# Altium schematic sheet ESP32.SchDoc: =ProjectName
size A4; CheckedBy: DatNB; Author: Ven; CompanyName: Nacentech; Organization: IMET
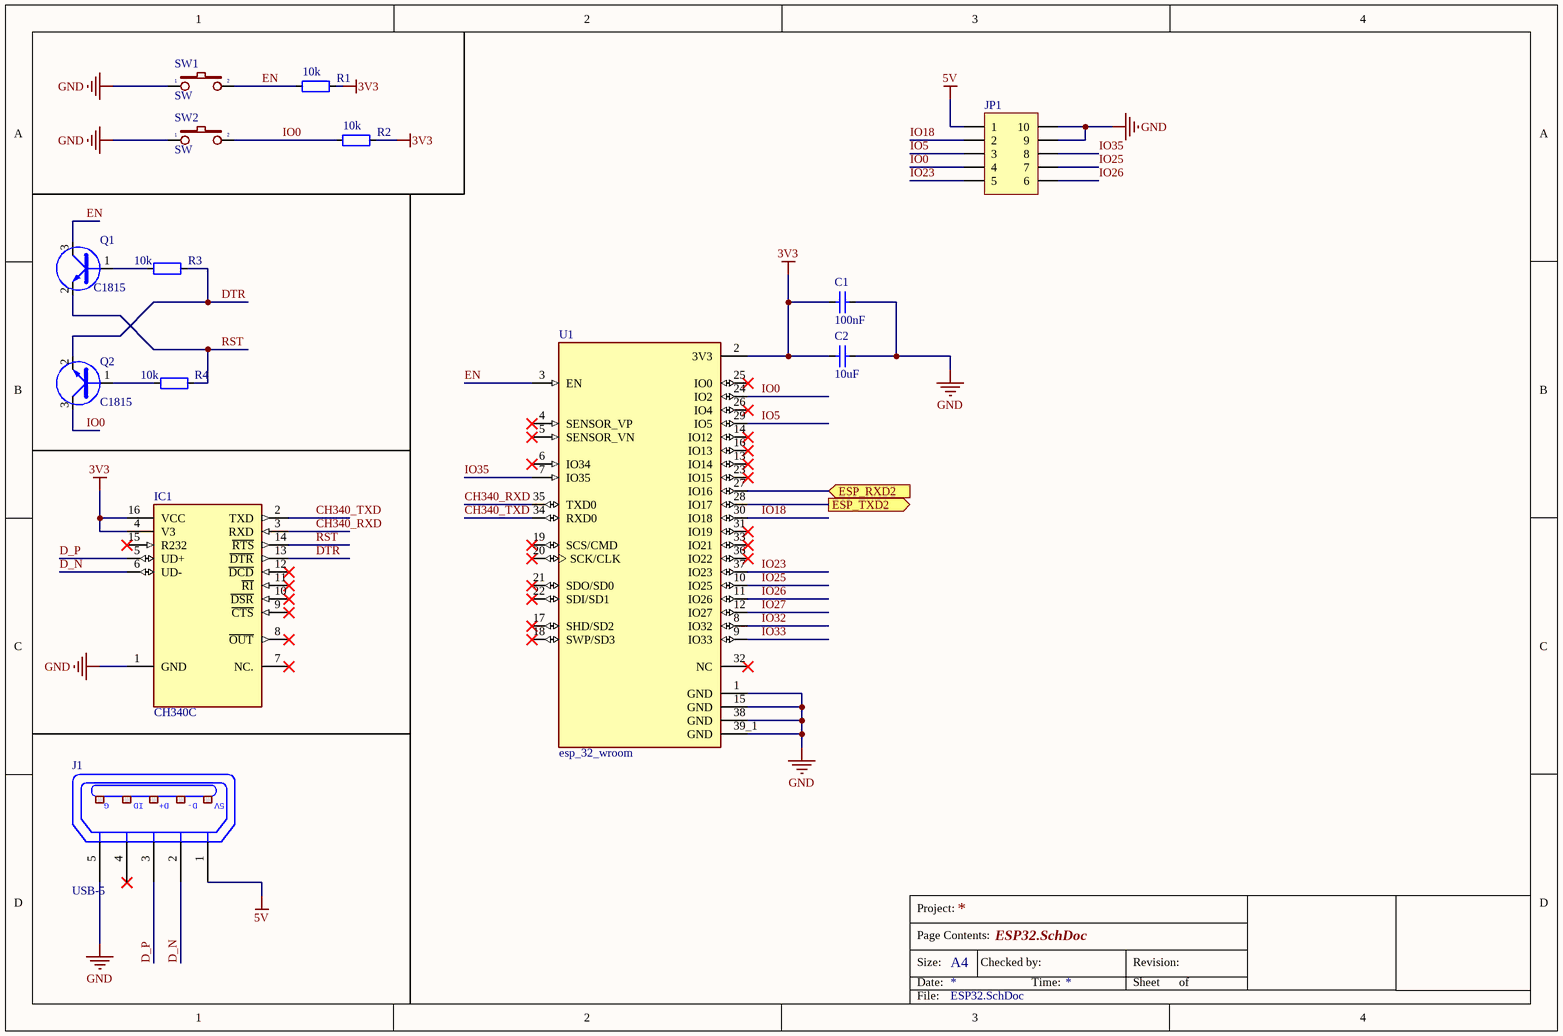
[diagram p0: ESP32.SchDoc]

## Parts
C1  100nF  [CAP_0805]
C2  10uF  [CAP_0805]
IC1  CH340C  [SO16]
J1  USB-5  [USB-M1]
JP1  JP 2x5 2.54  [JP5-D2T]  (value not drawn)
Q1  C1815  [SOT23D]
Q2  C1815  [SOT23D]
R1  10k  [RES-SMD-0805]
R2  10k  [RES-SMD-0805]
R3  10k  [RES-SMD-0805]
R4  10k  [RES-SMD-0805]
SW1  SW  [SW2]
SW2  SW  [SW2]
U1  esp_32_wroom  [MODULE_ESP32-WROOM-32]

## Ports
ESP_RXD2 (in), ESP_TXD2 (out)

## Nets
3V3: C1.1 C2.1 IC1.4(V3) IC1.16(VCC) R1.1 R2.1 U1.2(3V3)
5V: J1.1(P1) JP1.1
GND: C1.2 C2.2 IC1.1(GND) J1.5(P5) JP1.9 JP1.10 SW1.1 SW2.1 U1.1(GND) U1.15(GND) U1.38(GND) U1.39_1(GND)
CH340_RXD: IC1.3(RXD) U1.35(TXD0)
CH340_TXD: IC1.2(TXD) U1.34(RXD0)
D_N: IC1.6(UD-) J1.2(P2)
D_P: IC1.5(UD+) J1.3(P3)
DTR: IC1.13(~{DTR}) Q2.2(E) R3.1
EN: Q1.3(C) R1.2 SW1.2 U1.3(EN)
ESP_RXD2: U1.27(IO16) ; port ESP_RXD2
ESP_TXD2: U1.28(IO17) ; port ESP_TXD2
IO0: JP1.4 Q2.3(C) R2.2 SW2.2 U1.24(IO2)
IO5: JP1.3 U1.29(IO5)
IO18: JP1.2 U1.30(IO18)
IO23: JP1.5 U1.37(IO23)
IO25: JP1.7 U1.10(IO25)
IO26: JP1.6 U1.11(IO26)
IO27: U1.12(IO27)
IO32: U1.8(IO32)
IO33: U1.9(IO33)
IO35: JP1.8 U1.7(IO35)
RST: IC1.14(~{RTS}) Q1.2(E) R4.1
NetQ1_1: Q1.1(B) R3.2
NetQ2_1: Q2.1(B) R4.2

Not connected (* = marked no-connect by the designer): IC1 7(NC.)* 8(~{OUT})* 9(~{CTS})* 10(~{DSR})* 11(~{RI})* 12(~{DCD})* 15(R232)*; J1 4(P4)*; U1 4(SENSOR_VP)* 5(SENSOR_VN)* 6(IO34)* 13(IO14)* 14(IO12)* 16(IO13)* 17(SHD/SD2)* 18(SWP/SD3)* 19(SCS/CMD)* 20(SCK/CLK)* 21(SDO/SD0)* 22(SDI/SD1)* 23(IO15)* 25(IO0)* 26(IO4)* 31(IO19)* 32(NC)* 33(IO21)* 36(IO22)*

## Notes on the sheet
- Project:
- Page Contents:
- Size:
- Date:
- A4
- Checked by:
- Time:
- Revision:
- Sheet
- of
- File:
- (in symbol USB-5) G; ID; D+; D-; 5V

## Library data of the parts
C1 C2 = CapSMD: Capacitor; Value: 33p; Published: 8-Jun-2000; LatestRevisionDate: 17-Jul-2002; LatestRevisionNote: Re-released for DXP Platform.; PackageReference: RAD-0.3; Publisher: Altium Limited
J1 = USB-5: Manufacturer: FCI; Manufacturer Part Number: 10118193-0001LF; Connector Type: USB - micro B; Number of Contacts: 5; Gender: Receptacle; Specifications: USB 2.0; .Creator: MM; .Checked PCB: RF; Supplier 1: Digi-Key; RoHS: RoHS Compliant; Category: Connectors, Interconnects; Stock 1: 28642; Pricing 1: 1=0.46, 10=0.433, 25=0.3712, 50=0.3156, 100=0.3032, 250=0.27224, 500=0.25988 (USD); Packaging: Cut Tape (CT); Mounting Type: Surface Mount, Right Angle, Horizontal; Features: Shielded, Solder Retention; Ingress Protection: -; ComponentLink1URL: http://portal.fciconnect.com/Comergent//fci/drawing/10118193.pdf; ComponentLink1Description: http://portal.fciconnect.com/Comergent//fci/drawing/10118193.pdf; Supplier Part Number 1: 609-4616-1-ND; .Checked SCH: MM
JP1 = JP 2x5 2.54 Duc Thang: Cắm; Ten_Linh_Kien: Jump Đôi Đực 2.54MM 2x40P Thẳng 11MM; Don_Vi: Con; Ma_Hang: MH002686; Ghi_Chu: *; Kieu_Chan: *; Chung_Loai: Cắm
Q1 Q2 = 2SC1815: NPN 600mW, ECB; Value: C1815
R1-R4 = Resistor - SMD: Resistor; Manufacturer: Generic Components; Class: Passive; Published: 08/06/2000; Publisher: Altium Hobart Technology Centre
SW1 SW2 = SW2: Switch button 2 pin; Value: SW chip 2 pin